# Altium schematic sheet PT2262.SchDoc
size A4
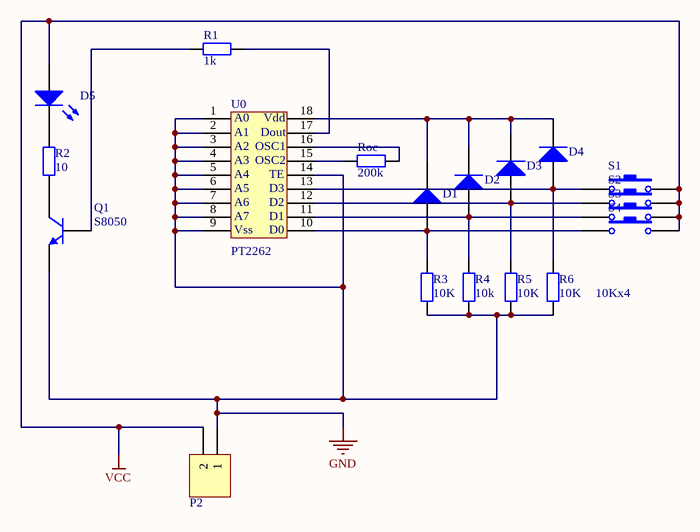
[diagram p0: PT2262.SchDoc]

## Parts
D1  Diode  [DIODE4]  (value not drawn)
D2  Diode  [DIODE4]  (value not drawn)
D3  Diode  [DIODE4]  (value not drawn)
D4  Diode  [DIODE4]  (value not drawn)
D5  (no value)  [LEDLXH-3]
P2  Header 2  [POWER PLUG2]  (value not drawn)
Q1  S8050  [NPN-2]
R1  value 1k  [AXIAL-0.4]  (hidden comment: Res2)
R2  value 10  [AXIAL-0.4]  (hidden comment: Res2)
R3  value 10K  [AXIAL-0.4]  (hidden comment: Res2)
R4  value 10k  [AXIAL-0.4]  (hidden comment: Res2)
R5  value 10K  [AXIAL-0.4]  (hidden comment: Res2)
R6  10Kx4  value 10K  [AXIAL-0.4]
Roc  value 200k  [AXIAL-0.4]  (hidden comment: Res2)
S1  SW-PB  [AN-S]  (value not drawn)
S2  SW-PB  [AN-S]  (value not drawn)
S3  SW-PB  [AN-S]  (value not drawn)
S4  SW-PB  [AN-S]  (value not drawn)
U0  PT2262  [DIP-18]

## Nets
GND: P2.1 Q1.1(E) R3.1 R4.1 R5.1 R6.1 U0.1 U0.2 U0.3 U0.4 U0.5 U0.6 U0.7 U0.8 U0.9 U0.14
VCC: D5.1(A) P2.2 S1.2 S2.2 S3.2 S4.2
NetD1_1: D1.1(A) R3.2 S4.1 U0.10
NetD1_2: D1.2(K) D2.2(K) D3.2(K) D4.2(K) U0.18
NetD2_1: D2.1(A) R4.2 S3.1 U0.11
NetD3_1: D3.1(A) R5.2 S2.1 U0.12
NetD4_1: D4.1(A) R6.2 S1.1 U0.13
NetD5_2: D5.2(K) R2.2
NetQ1_2: Q1.2(B) R1.1
NetQ1_3: Q1.3(C) R2.1
NetR1_2: R1.2 U0.17
NetRoc_1: Roc.1 U0.16
NetRoc_2: Roc.2 U0.15

## Notes on the sheet
- (in symbol PT2262) A0; Vdd; A1; Dout; A2; OSC1; A3; OSC2; A4; TE; A5; D3; A6; D2; A7; D1; Vss; D0

## Library data of the parts
D1-D4 = Diode: Default Diode; Published: 8-Jun-2000; LatestRevisionDate: 17-Jul-2002; LatestRevisionNote: Re-released for DXP Platform.; PackageDocument: Sep-1996; PackageReference: SMC; Publisher: Altium Limited; Code_JEDEC: DO-214-AB
D5 = LED0: Typical INFRARED GaAs LED; Published: 8-Jun-2000; LatestRevisionDate: 08-Jul-2005; LatestRevisionNote: Mech Layer 1 removed.; PackageReference: LED-0; Publisher: Altium Limited
P2 = Header 2: Header, 2-Pin; LatestRevisionDate: 17-Jul-2002; LatestRevisionNote: Re-released for DXP Platform.; Publisher: Altium Limited
Q1 = 2N3904: NPN General Purpose Amplifier; Published: 8-Jun-2000; LatestRevisionDate: 15-Jan-2003; LatestRevisionNote: PCB Footprint 'BCY-W3/D4.7' replaced; DatasheetDocument: 1997; PackageDocument: Sep-1998; PackageReference: TO-92A; Publisher: Altium Limited; Code_JEDEC: TO-92A; ComponentLink1Description: Manufacturer Link; ComponentLink1URL: http://www.fairchildsemi.com/; ComponentLink2Description: Datasheet; ComponentLink2URL: http://www.fairchildsemi.com/ds/2N%2F2N3904.pdf
R1-R6 Roc = Res2: Resistor; Published: 8-Jun-2000; LatestRevisionDate: 17-Jul-2002; LatestRevisionNote: Re-released for DXP Platform.; PackageReference: AXIAL-0.4; Publisher: Altium Limited
S1-S4 = SW-PB: Switch; Published: 24-Mar-1999; LatestRevisionDate: 17-Jul-2002; LatestRevisionNote: Re-released for DXP Platform.; PackageReference: SPST-2; Publisher: Altium Limited